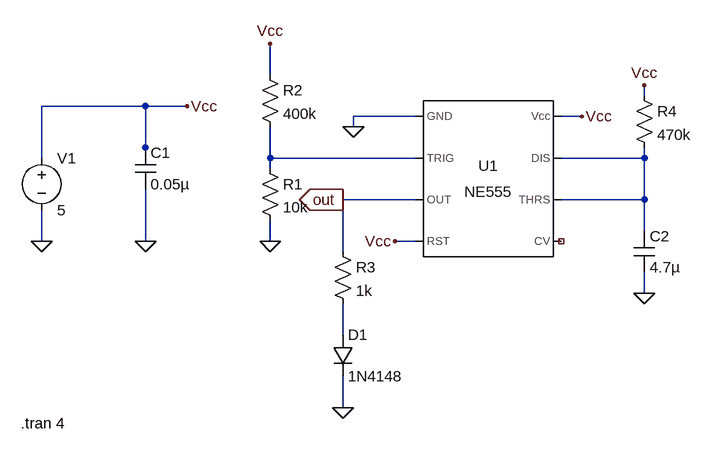
[diagram p0: schematic Monostable_Multivibrator.asc]
Monostable_Multivibrator.asc, the LTspice schematic file:
Version 4
SHEET 1 1176 680
WIRE 256 -32 256 -80
WIRE 832 0 832 -16
WIRE 64 16 -96 16
WIRE 128 16 64 16
WIRE 480 32 384 32
WIRE 736 32 704 32
WIRE 384 48 384 32
WIRE 64 80 64 16
WIRE -96 96 -96 16
WIRE 64 96 64 80
WIRE 256 96 256 48
WIRE 480 96 256 96
WIRE 832 96 832 80
WIRE 832 96 704 96
WIRE 256 112 256 96
WIRE 480 160 368 160
WIRE 832 160 832 96
WIRE 832 160 704 160
WIRE 832 208 832 160
WIRE -96 224 -96 176
WIRE 64 224 64 144
WIRE 256 224 256 192
WIRE 480 224 448 224
WIRE 368 240 368 160
WIRE 832 304 832 272
WIRE 368 368 368 320
WIRE 368 480 368 432
FLAG -96 224 0
FLAG 64 224 0
FLAG 128 16 Vcc
FLAG 384 48 0
FLAG 256 224 0
FLAG 256 -80 Vcc
FLAG 448 224 Vcc
FLAG 368 480 0
FLAG 368 160 out
IOPIN 368 160 Out
FLAG 832 304 0
FLAG 832 -16 Vcc
FLAG 736 32 Vcc
SYMBOL voltage -96 80 R0
WINDOW 123 0 0 Left 0
WINDOW 39 0 0 Left 0
SYMATTR InstName V1
SYMATTR Value 5
SYMBOL cap 48 80 R0
SYMATTR InstName C1
SYMATTR Value 0.05µ
SYMBOL Misc\\NE555 592 128 R0
SYMATTR InstName U1
SYMBOL res 240 96 R0
SYMATTR InstName R1
SYMATTR Value 10k
SYMBOL res 240 -48 R0
SYMATTR InstName R2
SYMATTR Value 400k
SYMBOL res 352 224 R0
SYMATTR InstName R3
SYMATTR Value 1k
SYMBOL cap 816 208 R0
SYMATTR InstName C2
SYMATTR Value 4.7µ
SYMBOL res 816 -16 R0
SYMATTR InstName R4
SYMATTR Value 470k
SYMBOL diode 352 368 R0
SYMATTR InstName D1
SYMATTR Value 1N4148
TEXT -128 504 Left 2 !.tran 4

The netlist it stands for:
* Monostable_Multivibrator.asc
V1 Vcc 0 5
C1 Vcc 0 0.05µ
XU1 0 N001 out Vcc NC_01 N002 N002 Vcc NE555  ; pins GND TRIG OUT RST CV THRS DIS Vcc
R1 N001 0 10k
R2 Vcc N001 400k
R3 out N003 1k
C2 N002 0 4.7µ
R4 Vcc N002 470k
D1 N003 0 1N4148
.model D D
.lib standard.dio
.tran 4
.lib NE555.sub
.backanno
.end